# Altium schematic sheet Microcontroller.SchDoc
size A3 portrait; Organization: Altium Limited; Address1: L3, 12a Rodborough Rd; Address2: Frenchs Forest; Address3: NSW; Address4: Australia 2086
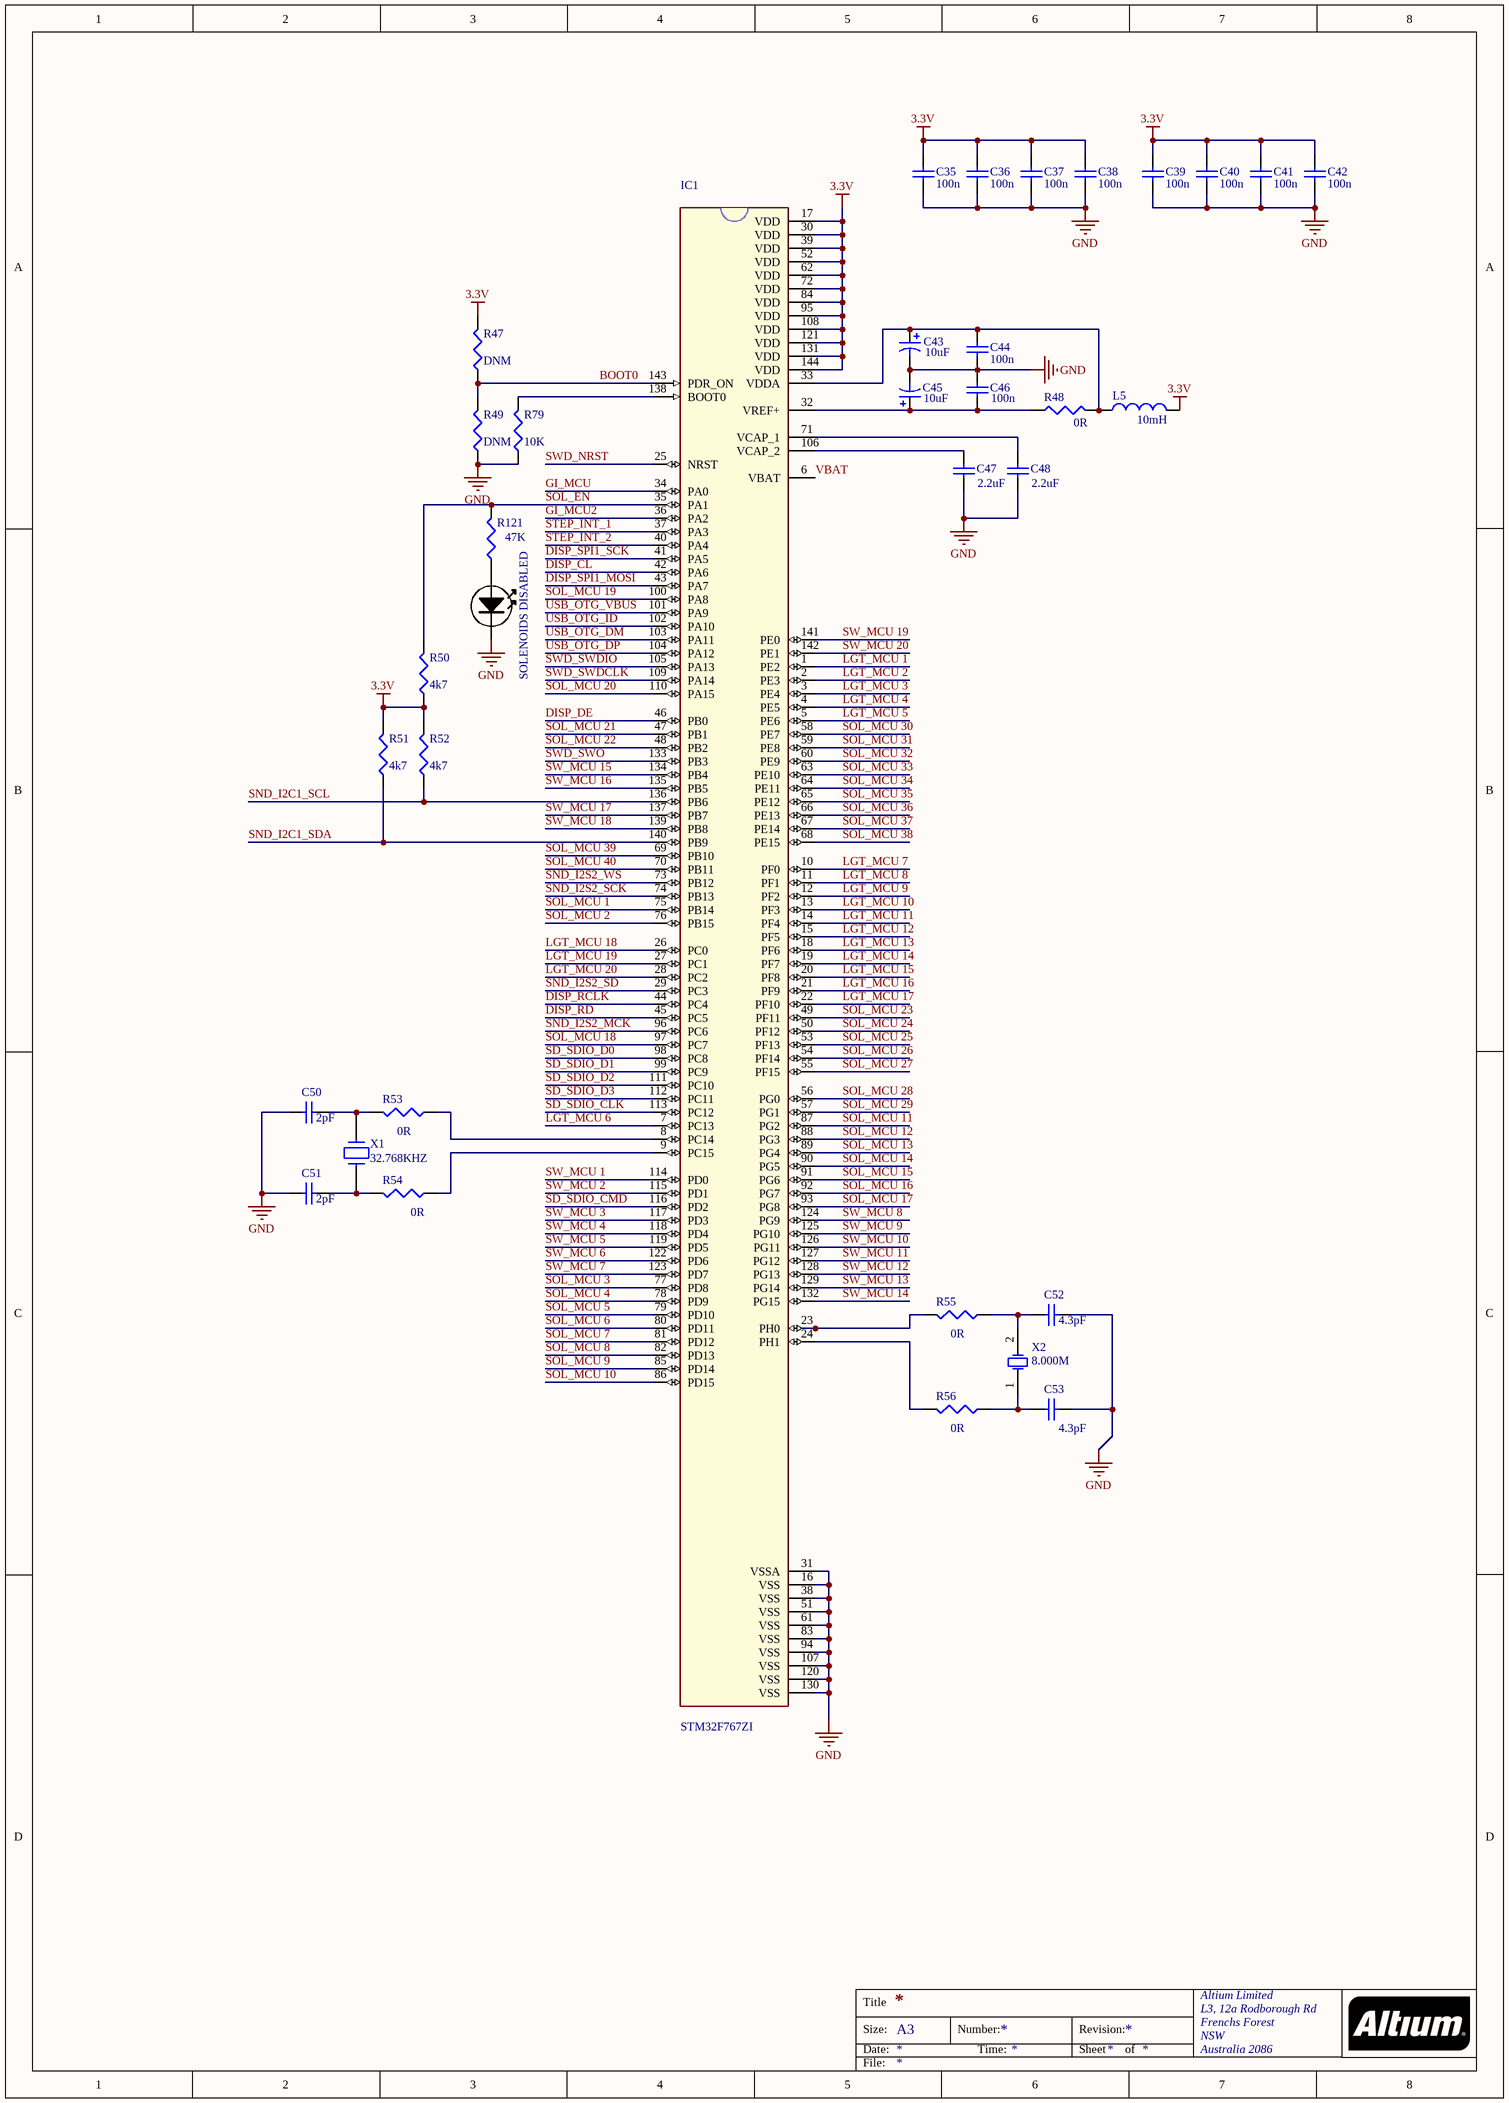
[diagram p0: Microcontroller.SchDoc]

## Parts
C35  value 100n  [0805C-GENERIC]  (hidden comment: Cap Semi)
C36  value 100n  [0805C-GENERIC]  (hidden comment: Cap Semi)
C37  value 100n  [0805C-GENERIC]  (hidden comment: Cap Semi)
C38  value 100n  [0805C-GENERIC]  (hidden comment: Cap Semi)
C39  value 100n  [0805C-GENERIC]  (hidden comment: Cap Semi)
C40  value 100n  [0805C-GENERIC]  (hidden comment: Cap Semi)
C41  value 100n  [0805C-GENERIC]  (hidden comment: Cap Semi)
C42  value 100n  [0805C-GENERIC]  (hidden comment: Cap Semi)
C43  value 10uF  [0805C-GENERIC]  (hidden comment: Cap Pol3)
C44  value 100n  [0805C-GENERIC]  (hidden comment: Cap Semi)
C45  value 10uF  [0805C-GENERIC]  (hidden comment: Cap Pol3)
C46  value 100n  [0805C-GENERIC]  (hidden comment: Cap Semi)
C47  value 2.2uF  [0805C-GENERIC]  (hidden comment: Cap Semi)
C48  value 2.2uF  [0805C-GENERIC]  (hidden comment: Cap Semi)
C50  value 2pF  [0805C-GENERIC]  (hidden comment: Cap Semi)
C51  value 2pF  [0805C-GENERIC]  (hidden comment: Cap Semi)
C52  value 4.3pF  [0805C-GENERIC]  (hidden comment: Cap Semi)
C53  value 4.3pF  [0805C-GENERIC]  (hidden comment: Cap Semi)
IC1  STM32F767ZI  [TSQFP50P2200X2200X160-144N]
L5  value 10mH  [0805FB-GENERIC]  (hidden comment: Inductor)
R47  value DNM  [0805R-GENERIC]  (hidden comment: Res3)
R48  value 0R  [0805R-GENERIC]  (hidden comment: Res3)
R49  value DNM  [0805R-GENERIC]  (hidden comment: Res3)
R50  value 4k7  [0805R-GENERIC]  (hidden comment: Res3)
R51  value 4k7  [0805R-GENERIC]  (hidden comment: Res3)
R52  value 4k7  [0805R-GENERIC]  (hidden comment: Res3)
R53  value 0R  [0805R-GENERIC]  (hidden comment: Res3)
R54  value 0R  [0805R-GENERIC]  (hidden comment: Res3)
R55  value 0R  [0805R-GENERIC]  (hidden comment: Res3)
R56  value 0R  [0805R-GENERIC]  (hidden comment: Res3)
R79  value 10K  [0805R-GENERIC]  (hidden comment: Res3)
R121  value 47K  [0805R-GENERIC]  (hidden comment: Res3)
SOLENOIDS_DISABLED  LED-RED-3MM  [LED-3MM-RED]  (value not drawn)
X1  32.768KHZ  [XTAL_2SM_3R2X1R5]
X2  8.000M  [OSC_2SM_3R2x2R5]

## Nets
3.3V: C35.2 C36.2 C37.2 C38.2 C39.2 C40.2 C41.2 C42.2 IC1.17(VDD) IC1.30(VDD) IC1.39(VDD) IC1.52(VDD) IC1.62(VDD) IC1.72(VDD) IC1.84(VDD) IC1.95(VDD) IC1.108(VDD) IC1.121(VDD) IC1.131(VDD) IC1.144(VDD) L5.2 R47.2 R50.1 R51.2 R52.2
GND: C35.1 C36.1 C37.1 C38.1 C39.1 C40.1 C41.1 C42.1 C43.2 C44.1 C45.2 C46.2 C47.1 C48.1 C50.1 C51.1 C52.2 C53.2 IC1.16(VSS) IC1.31(VSSA) IC1.38(VSS) IC1.51(VSS) IC1.61(VSS) IC1.83(VSS) IC1.94(VSS) IC1.107(VSS) IC1.120(VSS) IC1.130(VSS) R49.1 R79.1 SOLENOIDS_DISABLED.K
BOOT0: IC1.143(PDR_ON) R47.1 R49.2
DISP_CL: IC1.42(PA6)
DISP_DE: IC1.46(PB0)
DISP_RCLK: IC1.44(PC4)
DISP_RD: IC1.45(PC5)
DISP_SPI1_MOSI: IC1.43(PA7)
DISP_SPI1_SCK: IC1.41(PA5)
GI_MCU: IC1.34(PA0)
GI_MCU2: IC1.36(PA2)
LGT_MCU 1: IC1.1(PE2)
LGT_MCU 2: IC1.2(PE3)
LGT_MCU 3: IC1.3(PE4)
LGT_MCU 4: IC1.4(PE5)
LGT_MCU 5: IC1.5(PE6)
LGT_MCU 6: IC1.7(PC13)
LGT_MCU 7: IC1.10(PF0)
LGT_MCU 8: IC1.11(PF1)
LGT_MCU 9: IC1.12(PF2)
LGT_MCU 10: IC1.13(PF3)
LGT_MCU 11: IC1.14(PF4)
LGT_MCU 12: IC1.15(PF5)
LGT_MCU 13: IC1.18(PF6)
LGT_MCU 14: IC1.19(PF7)
LGT_MCU 15: IC1.20(PF8)
LGT_MCU 16: IC1.21(PF9)
LGT_MCU 17: IC1.22(PF10)
LGT_MCU 18: IC1.26(PC0)
LGT_MCU 19: IC1.27(PC1)
LGT_MCU 20: IC1.28(PC2)
SD_SDIO_CLK: IC1.113(PC12)
SD_SDIO_CMD: IC1.116(PD2)
SD_SDIO_D0: IC1.98(PC8)
SD_SDIO_D1: IC1.99(PC9)
SD_SDIO_D2: IC1.111(PC10)
SD_SDIO_D3: IC1.112(PC11)
SND_I2C1_SCL: IC1.136(PB6) R52.1
SND_I2C1_SDA: IC1.140(PB9) R51.1
SND_I2S2_MCK: IC1.96(PC6)
SND_I2S2_SCK: IC1.74(PB13)
SND_I2S2_SD: IC1.29(PC3)
SND_I2S2_WS: IC1.73(PB12)
SOL_EN: IC1.35(PA1) R50.2 R121.2
SOL_MCU 1: IC1.75(PB14)
SOL_MCU 2: IC1.76(PB15)
SOL_MCU 3: IC1.77(PD8)
SOL_MCU 4: IC1.78(PD9)
SOL_MCU 5: IC1.79(PD10)
SOL_MCU 6: IC1.80(PD11)
SOL_MCU 7: IC1.81(PD12)
SOL_MCU 8: IC1.82(PD13)
SOL_MCU 9: IC1.85(PD14)
SOL_MCU 10: IC1.86(PD15)
SOL_MCU 11: IC1.87(PG2)
SOL_MCU 12: IC1.88(PG3)
SOL_MCU 13: IC1.89(PG4)
SOL_MCU 14: IC1.90(PG5)
SOL_MCU 15: IC1.91(PG6)
SOL_MCU 16: IC1.92(PG7)
SOL_MCU 17: IC1.93(PG8)
SOL_MCU 18: IC1.97(PC7)
SOL_MCU 19: IC1.100(PA8)
SOL_MCU 20: IC1.110(PA15)
SOL_MCU 21: IC1.47(PB1)
SOL_MCU 22: IC1.48(PB2)
SOL_MCU 23: IC1.49(PF11)
SOL_MCU 24: IC1.50(PF12)
SOL_MCU 25: IC1.53(PF13)
SOL_MCU 26: IC1.54(PF14)
SOL_MCU 27: IC1.55(PF15)
SOL_MCU 28: IC1.56(PG0)
SOL_MCU 29: IC1.57(PG1)
SOL_MCU 30: IC1.58(PE7)
SOL_MCU 31: IC1.59(PE8)
SOL_MCU 32: IC1.60(PE9)
SOL_MCU 33: IC1.63(PE10)
SOL_MCU 34: IC1.64(PE11)
SOL_MCU 35: IC1.65(PE12)
SOL_MCU 36: IC1.66(PE13)
SOL_MCU 37: IC1.67(PE14)
SOL_MCU 38: IC1.68(PE15)
SOL_MCU 39: IC1.69(PB10)
SOL_MCU 40: IC1.70(PB11)
STEP_INT_1: IC1.37(PA3)
STEP_INT_2: IC1.40(PA4)
SW_MCU 1: IC1.114(PD0)
SW_MCU 2: IC1.115(PD1)
SW_MCU 3: IC1.117(PD3)
SW_MCU 4: IC1.118(PD4)
SW_MCU 5: IC1.119(PD5)
SW_MCU 6: IC1.122(PD6)
SW_MCU 7: IC1.123(PD7)
SW_MCU 8: IC1.124(PG9)
SW_MCU 9: IC1.125(PG10)
SW_MCU 10: IC1.126(PG11)
SW_MCU 11: IC1.127(PG12)
SW_MCU 12: IC1.128(PG13)
SW_MCU 13: IC1.129(PG14)
SW_MCU 14: IC1.132(PG15)
SW_MCU 15: IC1.134(PB4)
SW_MCU 16: IC1.135(PB5)
SW_MCU 17: IC1.137(PB7)
SW_MCU 18: IC1.139(PB8)
SW_MCU 19: IC1.141(PE0)
SW_MCU 20: IC1.142(PE1)
SWD_NRST: IC1.25(NRST)
SWD_SWDCLK: IC1.109(PA14)
SWD_SWDIO: IC1.105(PA13)
SWD_SWO: IC1.133(PB3)
USB_OTG_DM: IC1.103(PA11)
USB_OTG_DP: IC1.104(PA12)
USB_OTG_ID: IC1.102(PA10)
USB_OTG_VBUS: IC1.101(PA9)
VBAT: IC1.6(VBAT)
NetC43_1: C43.1 C44.2 IC1.33(VDDA) L5.1 R48.2
NetC45_1: C45.1 C46.1 IC1.32(VREF+) R48.1
NetC47_2: C47.2 IC1.106(VCAP_2)
NetC48_2: C48.2 IC1.71(VCAP_1)
NetC50_2: C50.2 R53.2 X1.2
NetC51_2: C51.2 R54.2 X1.1
NetC52_1: C52.1 R55.1 X2.2(OSC2)
NetC53_1: C53.1 R56.1 X2.1(OSC1)
NetIC1_8: IC1.8(PC14) R53.1
NetIC1_9: IC1.9(PC15) R54.1
NetIC1_23: IC1.23(PH0) R55.2
NetIC1_24: IC1.24(PH1) R56.2
NetIC1_138: IC1.138(BOOT0) R79.2
NetR121_1: R121.1 SOLENOIDS_DISABLED.A

## Notes on the sheet
- Title
- Size:
- Date:
- A3
- Number:
- Time:
- Revision:
- Sheet
- of
- File:

## Library data of the parts
C35-C42 C44 C46-C48 C50-C53 = Cap Semi: Capacitor (Semiconductor SIM Model); Published: 8-Jun-2000; LatestRevisionDate: 29-May-2009; LatestRevisionNote: IPC-7351 Footprint Added.; PackageReference: C1206; Publisher: Altium Limited; PackageDescription: Chip Capacitor
C43 C45 = Cap Pol3: Polarized Capacitor (Surface Mount); Published: 8-Jun-2000; LatestRevisionDate: 29-May-2009; LatestRevisionNote: IPC-7351 Footprint Added.; PackageReference: C0805; Publisher: Altium Limited; PackageDescription: Chip Capacitor
IC1 = STM32F407ZGT6: IC MCU 32BIT 1MB FLASH 144LQFP; MF: STMicroelectronics; MP: STM32F407ZGT6; Availability: Good; Package: LQFP-144 STMicroelectronics; Price: 11.63 USD; Value: *
L5 = Inductor: Code_IEC: 1005; Published: 8-Jun-2000; LatestRevisionDate: 29-May-2009; LatestRevisionNote: IPC-7351 Footprint Added.; PackageReference: 0402-A; Publisher: Altium Limited; PackageDescription: Chip Inductor; Code_JEITA: 0402
R47-R56 R79 R121 = Res3: Resistor; Published: 8-Jun-2000; LatestRevisionDate: 29-May-2009; LatestRevisionNote: IPC-7351 Footprint Added.; PackageReference: J1-0603; Publisher: Altium Limited; PackageDescription: Chip Resistor
X1 = CRYSTAL_32K: Crystal
X2 = XTAL: Crystal Oscillator; Published: 8-Jun-2000; LatestRevisionDate: 17-Jul-2002; LatestRevisionNote: Re-released for DXP Platform.; PackageReference: R38; Publisher: Altium Limited